# EAGLE design TempProbe (EAGLE 7.3.0)
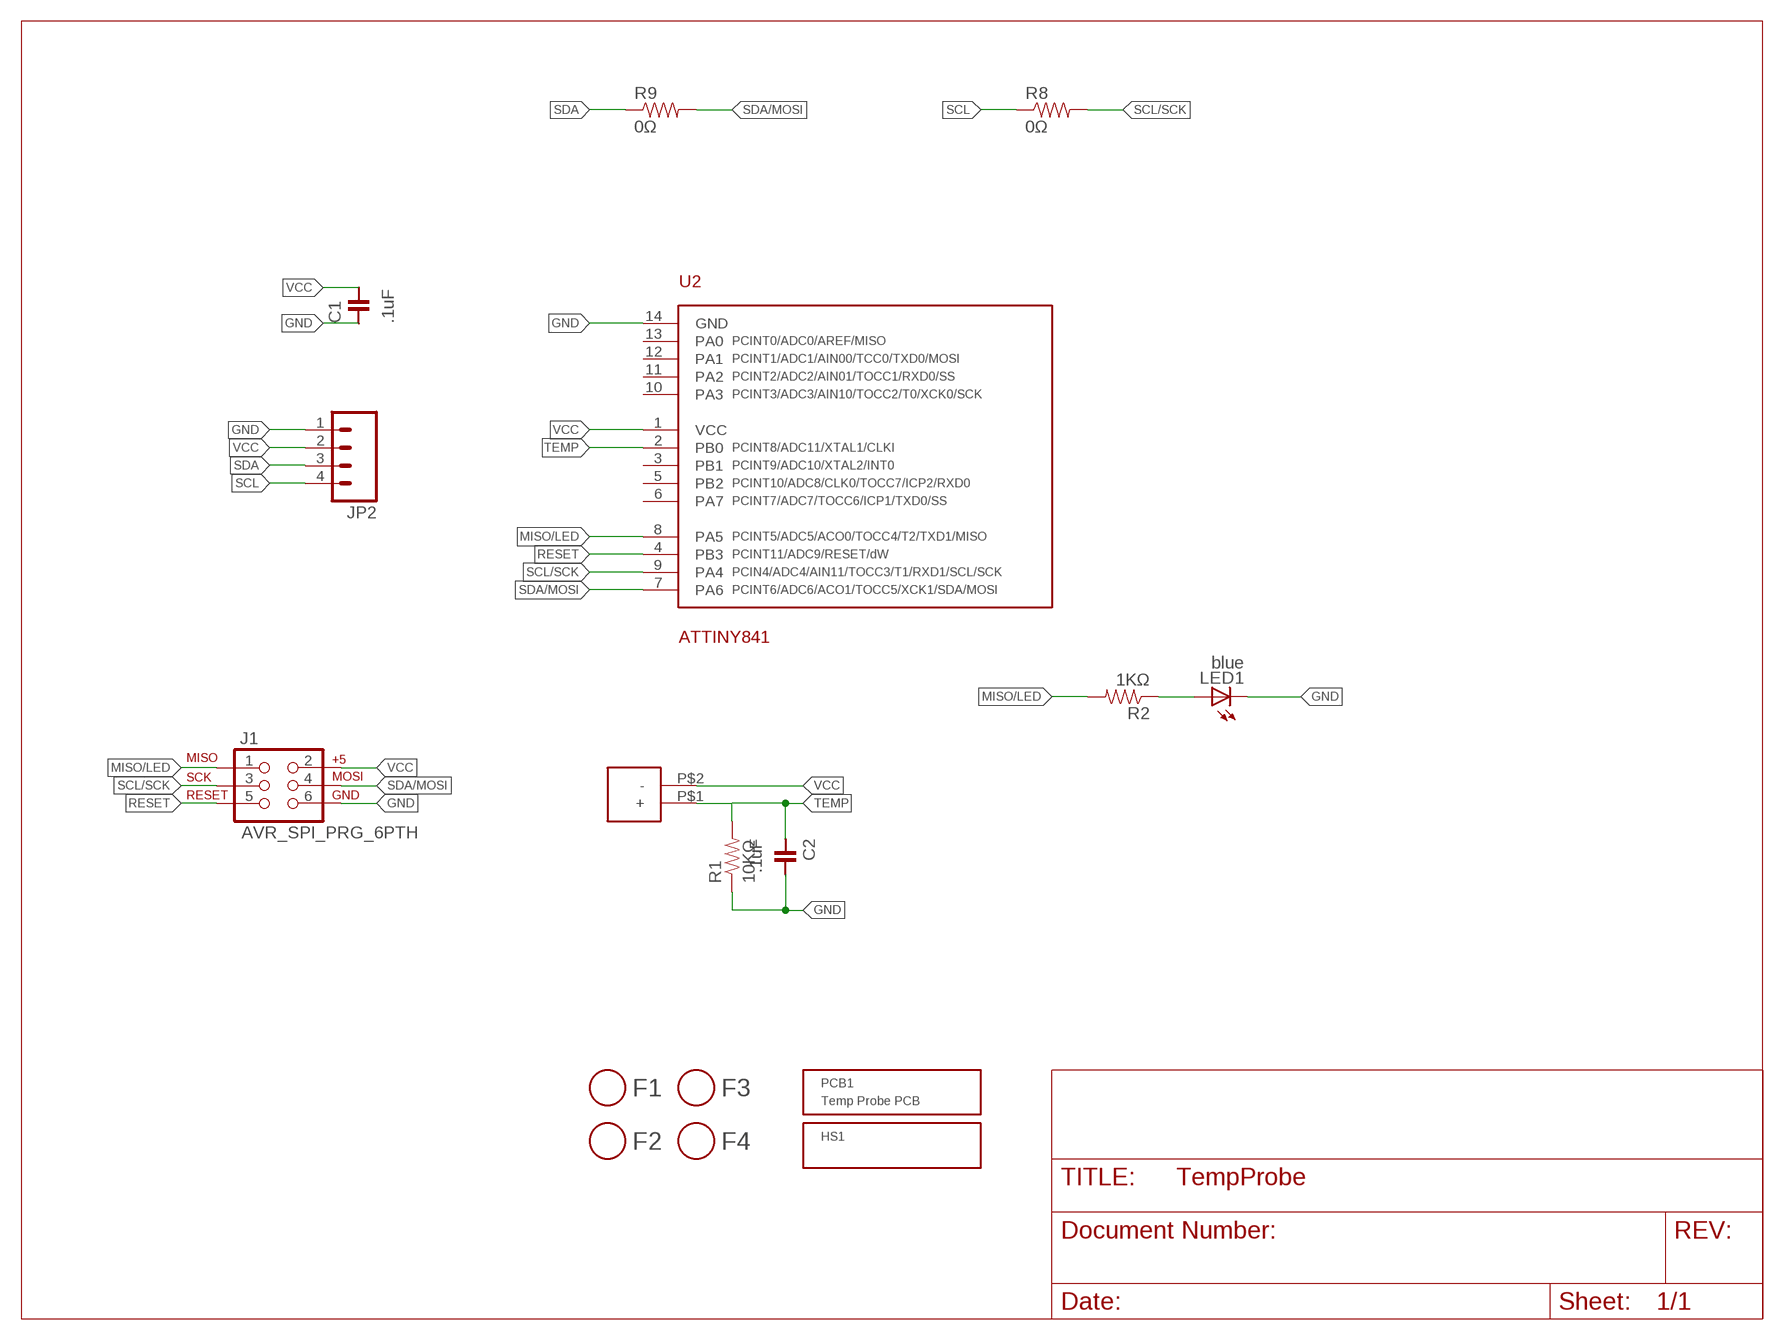
[diagram p0: schematic, sheet 1]
FRAME1 (LETTER_L): BOM: EXCLUDE
HS1 (BOM_ITEM): PARTNUM: F221B1/2 CL210
PCB1 (BOM_ITEM): PARTNUM: Temp Probe PCB

## Parts
C1  .1uF  CAPACITOR-.1UF  [0603]
C2  .1uF  CAPACITOR-.1UF  [0603]
F1  FIDUCIAL  [FIDUCIAL_1MM]
F2  FIDUCIAL  [FIDUCIAL_1MM]
F3  FIDUCIAL  [FIDUCIAL_1MM]
F4  FIDUCIAL  [FIDUCIAL_1MM]
J1  AVR_SPI_PRG_6PTH  [2X3]
JP2  M041X04_NO_SILK  [1X04_NO_SILK]
LED1  blue  LED-0805-BLUE  [0805-LED]
PROBE1  TEMP-PROBE  [TEMP_PROBE]
R1  10KΩ  RESISTOR-10KΩ  [0603]
R2  1KΩ  RESISTOR-1KΩ  [0603]
R8  0Ω  RESISTOR-0Ω  [0603]
R9  0Ω  RESISTOR-0Ω  [0603]
U2  ATTINY841  [SOIC-14]

## Nets
GND: C1.2 C2.1 J1.6 JP2.1 LED1.C R1.1 U2.14(GND)
MISO/LED: J1.1 R2.2 U2.8(PA5)
N$2: LED1.A R2.1
RESET: J1.5 U2.4(PB3)
SCL: JP2.4 R8.1
SCL/SCK: J1.3 R8.2 U2.9(PA4)
SDA: JP2.3 R9.1
SDA/MOSI: J1.4 R9.2 U2.7(PA6)
TEMP: C2.2 PROBE1.P$1(+) R1.2 U2.2(PB0)
VCC: C1.1 J1.2 JP2.2 PROBE1.P$2(-) U2.1(VCC)
Unconnected: U2.3(PB1) U2.5(PB2) U2.6(PA7) U2.10(PA3) U2.11(PA2) U2.12(PA1) U2.13(PA0)

## Library data of the parts
C1 C2 = Modulo:CAPACITOR: Capacitor; PARTNUM: C0603C104K5RACTU
F1-F4 = Modulo:FIDUCIAL; BOM: EXCLUDE
J1 = SparkFun-Connectors:AVR_SPI_PRG_6: AVR ISP 6 Pin This is the reduced ISP connector for AVR programming. Common on Arduino. This footprint will take up less PCB space and can be used with a 10-pin to 6-pin adapter such as SKU: BOB-08508; BOM: EXCLUDE
JP2 = SparkFun-Connectors:M04: Header 4 Standard 4-pin 0.1" header. Use with straight break away headers (SKU : PRT-00116), right angle break away headers (PRT-00553), swiss pins (PRT-00743), machine pins (PRT-00117), and female headers (PRT-00115). Molex polarized connector foot print use with SKU : PRT-08231 with associated crimp pins and housings. 1MM SMD Version SKU: PRT-10208; BOM: EXCLUDE
LED1 = Modulo:LED: LED; PARTNUM: LTST-C171TBKT
PROBE1 = Modulo:TEMP-PROBE; PARTNUM: NTCLE413E2103F102L
R1 = Modulo:RESISTOR: Resistor Basic schematic elements and footprints for 0603, 1206, and PTH resistors.; PARTNUM: ERJ-3EKF1002V
R2 = Modulo:RESISTOR: Resistor Basic schematic elements and footprints for 0603, 1206, and PTH resistors.; PARTNUM: ERJ-3EKF1001V
R8 R9 = Modulo:RESISTOR: Resistor Basic schematic elements and footprints for 0603, 1206, and PTH resistors.; BOM: EXCLUDE; PARTNUM: ERJ-3GEY0R00V
U2 = Modulo:ATTINY841; PARTNUM: ATTINY841-SSUR

## Board
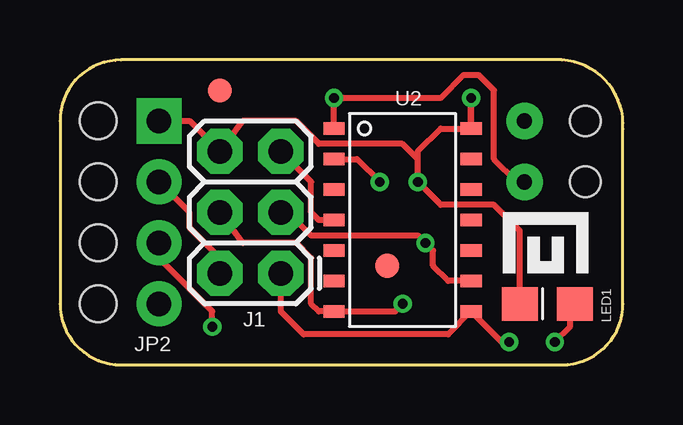
[diagram p1: board, top side]
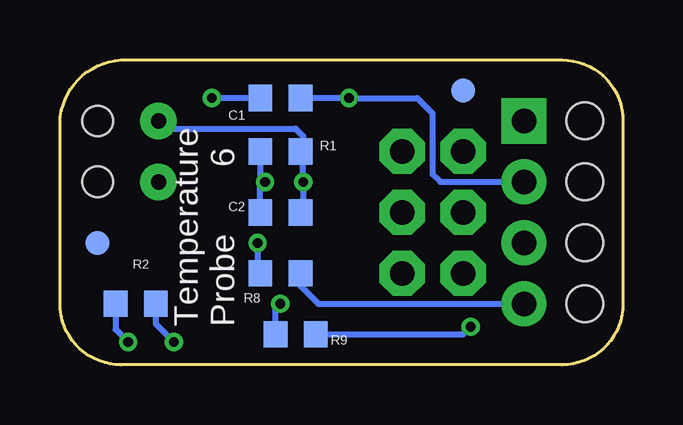
[diagram p2: board, bottom side, seen from below]

Size 23.48 x 12.7 mm. Coordinates in mm from the lower left corner, seen from the top.
Outline: 20.93,12.7 2.54,12.7 arc90 0,10.16 0,2.54 arc90 2.54,0 20.93,0 arc90 23.47,2.54 23.47,9.83 arc90 20.93,12.7
Copper layers (1*16): Top 0.0356mm / dielectric 1.5011mm / Bottom 0.0356mm
Design rules "Modulo": minimum track width 6mil, minimum drill 13mil, track to track 6mil, track to pad 6mil, pad to pad 6mil, via to via 6mil, smd to smd 6mil, copper to edge 15mil, drill to drill 6mil, minimum pad ring 7mil, minimum via ring 7mil, stop-mask expansion 3mil, vias tented up to drill 25mil, thermal gap 10mil
Holes 1.52 mm at 1.59,10.16 1.59,7.62 1.59,5.08 1.59,2.54

### Footprints (pad centres in the part's own frame; a part is rotated, then mirrored left to right if it is on the bottom)
0603 = smd 0.991 x 1.092: 1 -0.838,0; 2 0.838,0
FIDUCIAL_1MM = smd 1 x 1: 1 0,0
2X3 = drill 1.016 pad 1.88 octagon: 1 0,0; 2 0,2.54; 3 2.54,0; 4 2.54,2.54; 5 5.08,0; 6 5.08,2.54
1X04_NO_SILK = drill 1.016 pad 1.88 square: 1 0,0 | drill 1.016 pad 1.88: 2 2.54,0; 3 5.08,0; 4 7.62,0
0805-LED = smd 1.397 x 1.499: A 0,-1.143; C 0,1.143
TEMP_PROBE = drill 0.635 pad 1.524: P$1 -1.27,2.54; P$2 -1.27,0 | hole 1.27: 1.27,0; 1.27,2.54
SOIC-14 = smd 0.508 x 0.889: 1 0,-3.175; 2 1.27,-3.175; 3 2.54,-3.175; 4 3.81,-3.175; 5 5.08,-3.175; 6 6.35,-3.175; 7 7.62,-3.175; 8 7.62,2.54; 9 6.35,2.54; 10 5.08,2.54; 11 3.81,2.54; 12 2.54,2.54; 13 1.27,2.54; 14 0,2.54

### Placement (x,y rotation side)
C1  14.29,11.11 180 bottom
C2  14.29,6.35 0 bottom
F1  13.65,4.13 0 top
F2  21.91,5.08 0 bottom
F3  6.67,11.43 0 top
F4  6.67,11.43 0 bottom
J1  9.21,3.81 90 top
JP2  4.13,10.16 270 top
LED1  20.32,2.54 90 top
PROBE1  20.64,7.62 0 top
R1  14.29,8.89 0 bottom
R2  20.32,2.54 0 bottom
R8  14.29,3.81 180 bottom
R9  13.65,1.27 180 bottom
U2  14.61,9.84 270 top
U$1  [LOGO-TINY]  20,3.81 0 top

### Tracks (layer width: path | path; a pad name or v marks a point on that pad's centre or on a via)
GND  (via drill 0.41)
  Top 0.254: U2.14 v17.15,11.11 U2.14 | v14.92,7.62 14.92,8.57 14.29,9.21 10.79,9.21 9.84,10.16 7.62,10.16 J1.6 5.4,10.16 JP2.1 | v14.92,7.62 14.92,8.89 15.87,9.84 U2.14 | LED1.C 19.18,5.59 18.1,6.67 15.87,6.67 v14.92,7.62
  Bottom 0.254: C1.2 v17.15,11.11 | R1.1 15.13,7.82 v14.92,7.62 15.13,7.42 C2.1
MISO/LED  (via drill 0.41)
  Top 0.254: J1.1 9.21,2.22 10.16,1.27 16.19,1.27 U2.8 18.42,0.95 v18.73,0.95
  Bottom 0.254: R2.2 19.48,1.7 v18.73,0.95
N$2  (via drill 0.41)
  Top 0.254: 21.59,2.41 LED1.A 21.27,2.35 21.27,1.59 v20.64,0.95
  Bottom 0.254: R2.1 21.16,1.47 v20.64,0.95
RESET
  Top 0.254: U2.4 10.79,6.03 10.48,6.35 10.48,7.62 J1.5
SCL
  Bottom 0.254: R8.1 13.45,3.29 12.7,2.54 JP2.4
SCL/SCK  (via drill 0.41)
  Top 0.254: J1.3 9.52,6.35 10.48,5.4 14.92,5.4 v15.24,5.08 15.56,4.76 15.56,4.13 16.19,3.49 U2.9
  Bottom 0.254: v15.24,5.08 15.24,3.92 R8.2
SDA  (via drill 0.41)
  Top 0.254: v6.35,1.59 6.35,2.22 4.13,4.45 JP2.3
  Bottom 0.254: R9.1 6.67,1.27 v6.35,1.59
SDA/MOSI  (via drill 0.41)
  Top 0.254: v14.29,2.54 13.97,2.22 U2.7 10.79,2.22 10.48,2.54 10.48,4.45 9.84,5.08 7.62,5.08 J1.4
  Bottom 0.254: R9.2 14.49,2.34 v14.29,2.54
TEMP  (via drill 0.41)
  Top 0.254: U2.2 12.38,8.57 v13.34,7.62
  Bottom 0.254: C2.2 13.34,6.46 v13.34,7.62 13.34,8.78 R1.2 13.34,9 13.34,9.53 13.65,9.84 19.05,9.84 PROBE1.P$1
VCC  (via drill 0.41)
  Top 0.254: U2.1 v11.43,11.11 15.87,11.11 16.83,12.07 17.46,12.07 18.1,11.43 18.1,8.57 19.05,7.62 PROBE1.P$2 | J1.2 6.67,4.45 5.4,5.71 5.4,6.35 JP2.2
  Bottom 0.254: C1.1 v11.43,11.11 8.57,11.11 7.94,10.48 7.94,7.94 7.62,7.62 JP2.2

### Text on the board
bPlace: 6 | Temperature / Probe